# Altium schematic sheet PCA9685_sheet.SchDoc
size A4; SheetNumber: 1; SheetTotal: 1
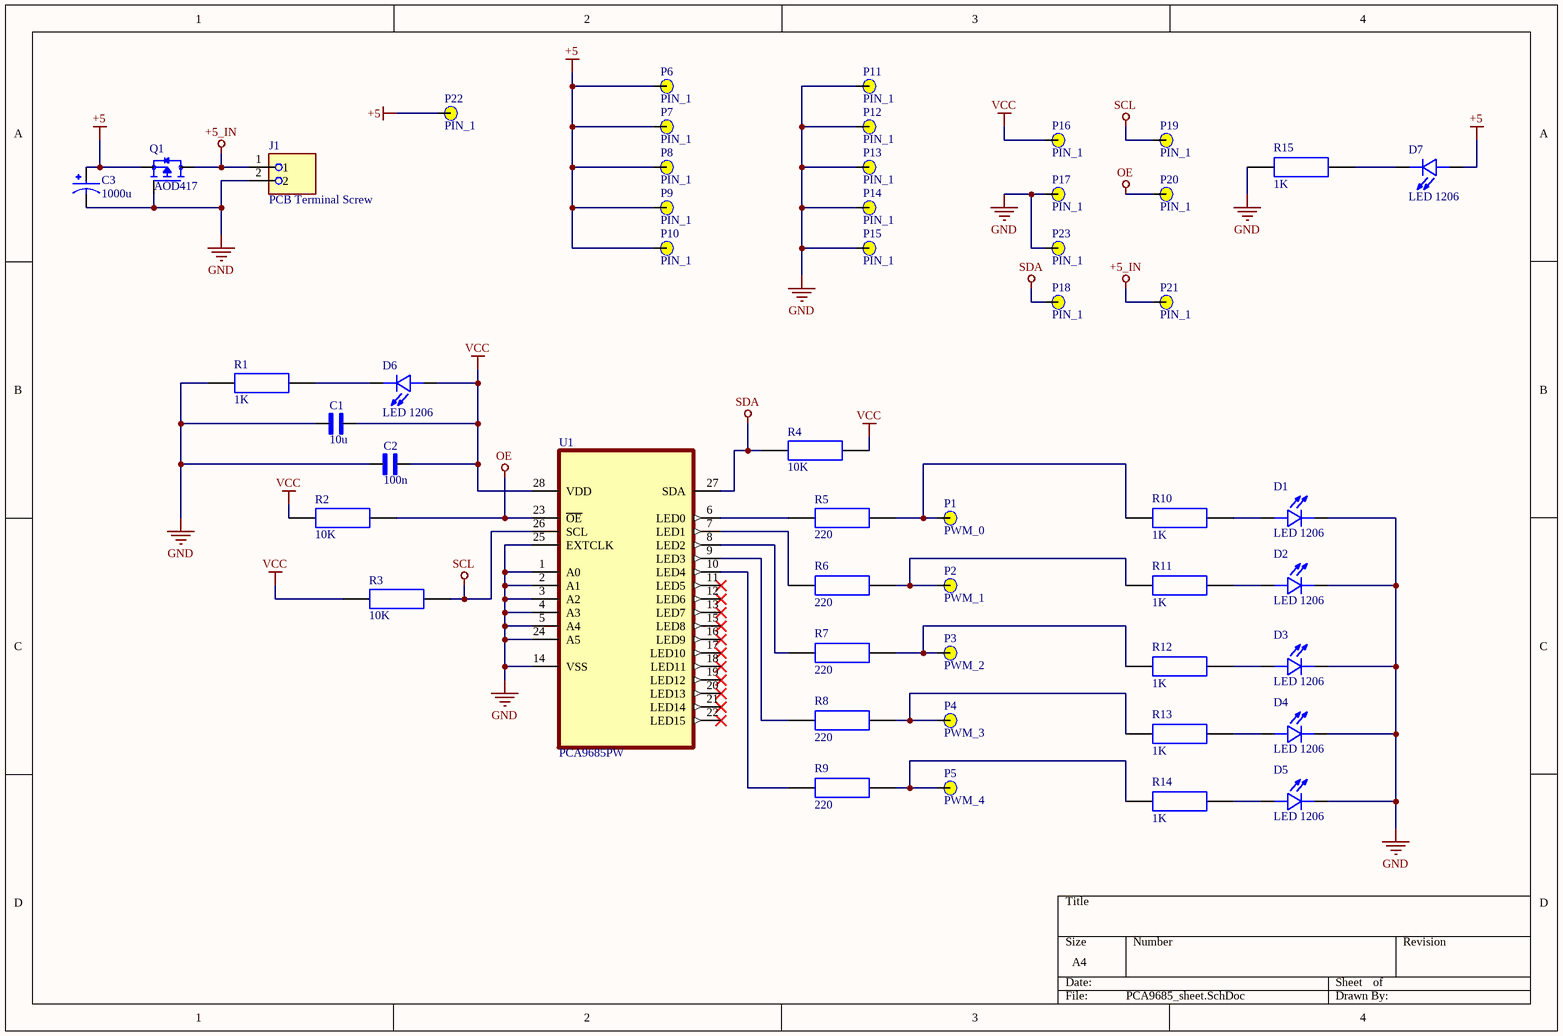
[diagram p0: PCA9685_sheet.SchDoc]

## Parts
C1  10u  [Capacitor 1206]
C2  100n  [Capacitor 1206]
C3  1000u  [Electrolytic capacitor]
D1  LED 1206  [LED 1206]
D2  LED 1206  [LED 1206]
D3  LED 1206  [LED 1206]
D4  LED 1206  [LED 1206]
D5  LED 1206  [LED 1206]
D6  LED 1206  [LED 1206]
D7  LED 1206  [LED 1206]
J1  PCB Terminal Screw  [PCB Terminal Screw]
P1  PWM_0  [PCB_Pin_1]  (no BOM)
P2  PWM_1  [PCB_Pin_1]  (no BOM)
P3  PWM_2  [PCB_Pin_1]  (no BOM)
P4  PWM_3  [PCB_Pin_1]  (no BOM)
P5  PWM_4  [PCB_Pin_1]  (no BOM)
P6  PIN_1  [PCB_Pin_1]  (no BOM)
P7  PIN_1  [PCB_Pin_1]  (no BOM)
P8  PIN_1  [PCB_Pin_1]  (no BOM)
P9  PIN_1  [PCB_Pin_1]  (no BOM)
P10  PIN_1  [PCB_Pin_1]  (no BOM)
P11  PIN_1  [PCB_Pin_1]  (no BOM)
P12  PIN_1  [PCB_Pin_1]  (no BOM)
P13  PIN_1  [PCB_Pin_1]  (no BOM)
P14  PIN_1  [PCB_Pin_1]  (no BOM)
P15  PIN_1  [PCB_Pin_1]  (no BOM)
P16  PIN_1  [PCB_Pin_1]  (no BOM)
P17  PIN_1  [PCB_Pin_1]  (no BOM)
P18  PIN_1  [PCB_Pin_1]  (no BOM)
P19  PIN_1  [PCB_Pin_1]  (no BOM)
P20  PIN_1  [PCB_Pin_1]  (no BOM)
P21  PIN_1  [PCB_Pin_1]  (no BOM)
P22  PIN_1  [PCB_Pin_1]  (no BOM)
P23  PIN_1  [PCB_Pin_1]  (no BOM)
Q1  AOD417  [Transistor AOD417]
R1  1K  [Resistor 1206]
R2  10K  [Resistor 1206]
R3  10K  [Resistor 1206]
R4  10K  [Resistor 1206]
R5  220  [Resistor 1206]
R6  220  [Resistor 1206]
R7  220  [Resistor 1206]
R8  220  [Resistor 1206]
R9  220  [Resistor 1206]
R10  1K  [Resistor 1206]
R11  1K  [Resistor 1206]
R12  1K  [Resistor 1206]
R13  1K  [Resistor 1206]
R14  1K  [Resistor 1206]
R15  1K  [Resistor 1206]
U1  PCA9685PW  [PCA9685PW]

## Nets
+5: C3.P D7.A P6.0(Pin) P7.0(Pin) P8.0(Pin) P9.0(Pin) P10.0(Pin) P22.0(Pin) Q1.3(S)
+5_IN: J1.1 P21.0(Pin) Q1.4(D)
GND: C1.1 C2.1 C3.N D1.C D2.C D3.C D4.C D5.C J1.2 P11.0(Pin) P12.0(Pin) P13.0(Pin) P14.0(Pin) P15.0(Pin) P17.0(Pin) P23.0(Pin) Q1.1(G) R1.1 R15.1 U1.1(A0) U1.2(A1) U1.3(A2) U1.4(A3) U1.5(A4) U1.14(VSS) U1.24(A5) U1.25(EXTCLK)
OE: P20.0(Pin) R2.2 U1.23(~{OE})
SCL: P19.0(Pin) R3.2 U1.26(SCL)
SDA: P18.0(Pin) R4.1 U1.27(SDA)
VCC: C1.2 C2.2 D6.A P16.0(Pin) R2.1 R3.1 R4.2 U1.28(VDD)
NetD1_A: D1.A R10.2
NetD2_A: D2.A R11.2
NetD3_A: D3.A R12.2
NetD4_A: D4.A R13.2
NetD5_A: D5.A R14.2
NetD6_C: D6.C R1.2
NetD7_C: D7.C R15.2
NetP1_0: P1.0(Pin) R5.2 R10.1
NetP2_0: P2.0(Pin) R6.2 R11.1
NetP3_0: P3.0(Pin) R7.2 R12.1
NetP4_0: P4.0(Pin) R8.2 R13.1
NetP5_0: P5.0(Pin) R9.2 R14.1
NetR5_1: R5.1 U1.6(LED0)
NetR6_1: R6.1 U1.7(LED1)
NetR7_1: R7.1 U1.8(LED2)
NetR8_1: R8.1 U1.9(LED3)
NetR9_1: R9.1 U1.10(LED4)

Not connected (* = marked no-connect by the designer): U1 11(LED5)* 12(LED6)* 13(LED7)* 15(LED8)* 16(LED9)* 17(LED10)* 18(LED11)* 19(LED12)* 20(LED13)* 21(LED14)* 22(LED15)*

## Library data of the parts
C1 C2 = Capacitor 1206: MF: AVX; MP: 12061C225K4T2A; Package: 3216 AVX; Value: *; SnapEDA_Link: https://www.snapeda.com/parts/12061C225K4T2A/AVX/view-part/?ref=snap; Check_prices: https://www.snapeda.com/parts/12061C225K4T2A/AVX/view-part/?ref=eda
C3 = Electrolytic capacitor: MP: EEUFR1A102LB; MF: Panasonic; SnapEDA_Link: https://www.snapeda.com/parts/EEUFR1A102LB/Panasonic/view-part/?ref=snap; Availability: In Stock; Price: None; Value: *; Check_prices: https://www.snapeda.com/parts/EEUFR1A102LB/Panasonic/view-part/?ref=eda; Package: RADIAL-2 Panasonic
D1-D7 = LED 1206: MF: Lite-On Inc.; MP: LTST-C230KGKT; SnapEDA_Link: https://www.snapeda.com/parts/LTST-C230KGKT/Lite-On/view-part/?ref=snap; Package: 1206 Lite-On; Value: *; Check_prices: https://www.snapeda.com/parts/LTST-C230KGKT/Lite-On/view-part/?ref=eda
J1 = PCB Terminal Screw: MF: Phoenix Contact; MP: 1729128; SnapEDA_Link: https://www.snapeda.com/parts/1729128/Phoenix+Contact/view-part/?ref=snap; Package: None; Value: *; Check_prices: https://www.snapeda.com/parts/1729128/Phoenix+Contact/view-part/?ref=eda
P1-P5 = PIN_1
Q1 = Transistor AOD417: MF: Alpha &; SnapEDA_Link: https://www.snapeda.com/parts/AOD417/Alpha%20%26%20Omega%20Semiconductor%20Inc./view-part/454934/?ref=snap; Availability: Unavailable; MP: AOD417; Price: None; Package: TO-252 Alpha &amp; Omega Semiconductor; Value: *
R1-R15 = Resistor 1206: MP: ERJU08F4703V; Package: None; Price: None; Availability: Unavailable; Value: *
U1 = PCA9685PW: MF: NXP USA; MP: PCA9685PW,118; SnapEDA_Link: https://www.snapeda.com/parts/PCA9685PW,118/NXP+Semiconductors/view-part/?ref=snap; Package: TSSOP-28 NXP Semiconductors; Value: *; Check_prices: https://www.snapeda.com/parts/PCA9685PW,118/NXP+Semiconductors/view-part/?ref=eda